# EAGLE schematic Sequencer-Memory-V1.0 (EAGLE 7.6.0)

## Sheet 1 of 4: CPU
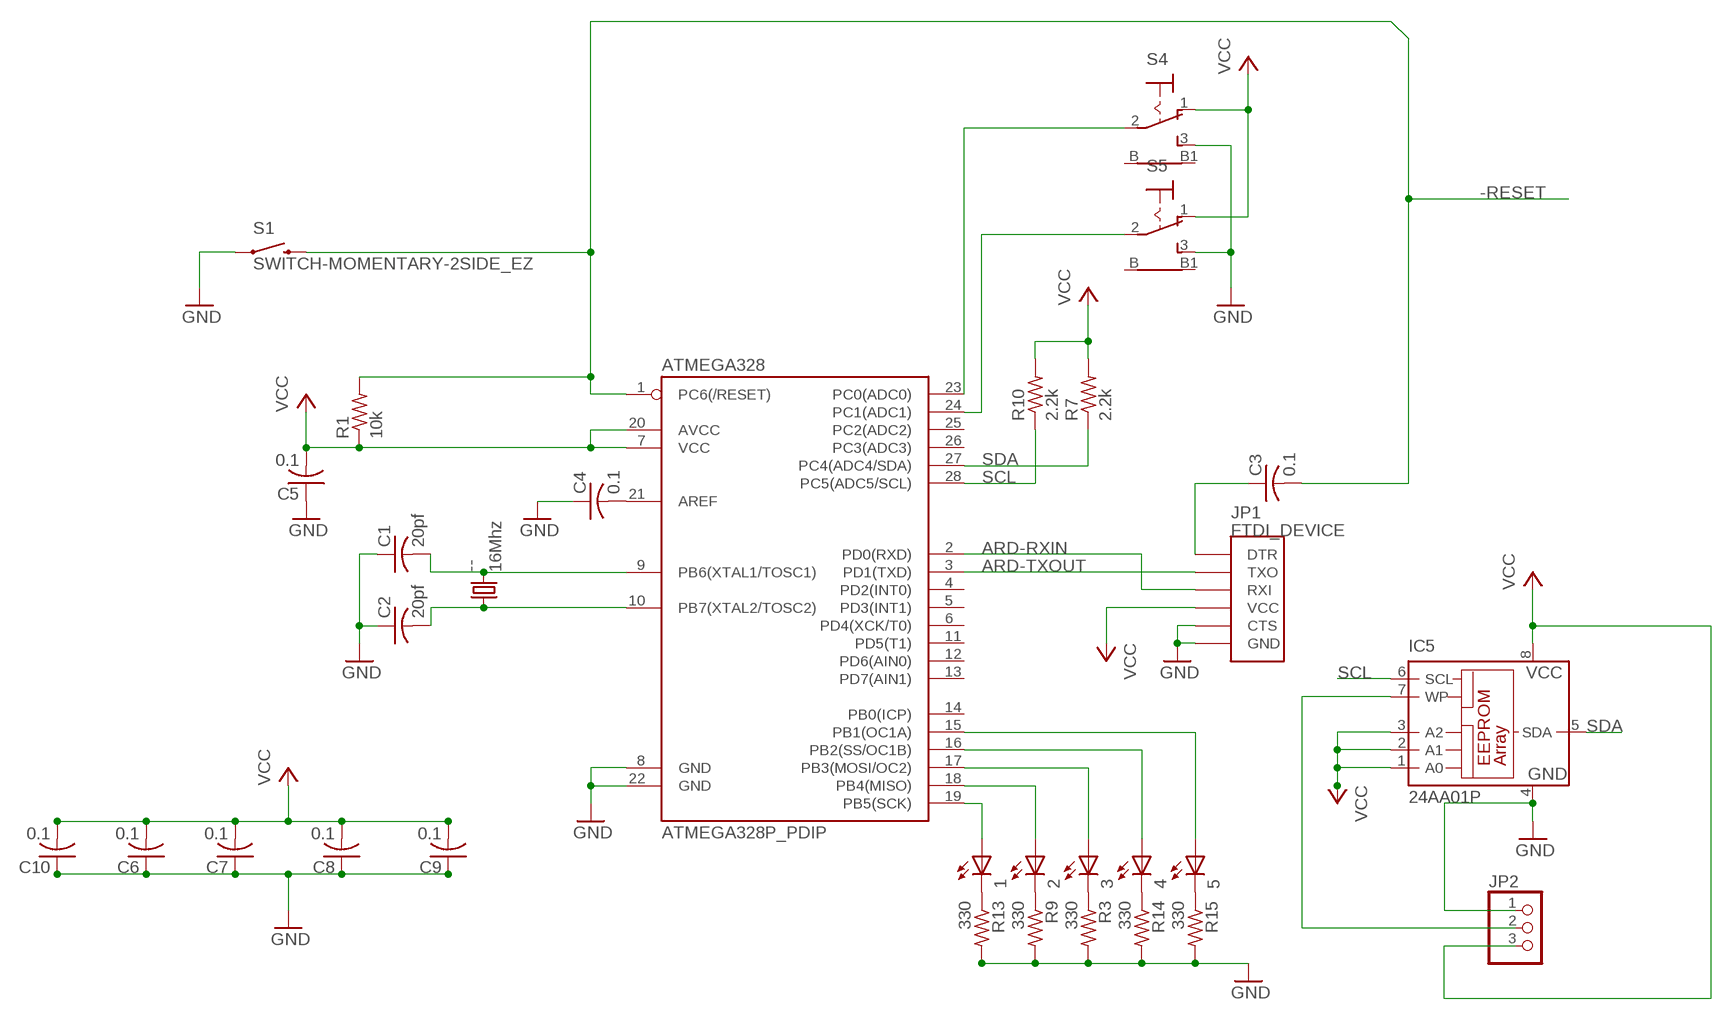
[diagram p0: schematic, sheet 1]

### Parts
1  LED5MM  [LED5MM]
2  LED5MM  [LED5MM]
3  LED5MM  [LED5MM]
4  LED5MM  [LED5MM]
5  LED5MM  [LED5MM]
--  16Mhz  CRYSTALHC49S  [HC49/S]
ATMEGA328  ATMEGA328P_PDIP  [DIL28-3]
C1  20pf  C-US025-024X044  [C025-024X044]
C2  20pf  C-US025-024X044  [C025-024X044]
C3  0.1  C-US025-024X044  [C025-024X044]
C4  0.1  C-US025-024X044  [C025-024X044]
C5  0.1  C-US025-024X044  [C025-024X044]
C6  0.1  C-US025-024X044  [C025-024X044]
C7  0.1  C-US025-024X044  [C025-024X044]
C8  0.1  C-US025-024X044  [C025-024X044]
C9  0.1  C-US025-024X044  [C025-024X044]
C10  0.1  C-US025-024X044  [C025-024X044]
IC5  24AA01P  [DIL8]
JP1  FTDI_DEVICE  [FTDI_DEVICE_SIDE]
JP2  PINHD-1X3  [1X03]
R1  10k  R-US_0207/10  [0207/10]
R3  330  R-US_0207/10  [0207/10]
R7  2.2k  R-US_0207/10  [0207/10]
R9  330  R-US_0207/10  [0207/10]
R10  2.2k  R-US_0207/10  [0207/10]
R13  330  R-US_0207/10  [0207/10]
R14  330  R-US_0207/10  [0207/10]
R15  330  R-US_0207/10  [0207/10]
S1  SWITCH-MOMENTARY-2SIDE_EZ  [TACTILE-PTH-SIDEEZ]
S4  9070-1W  [9070-1W]
S5  9070-1W  [9070-1W]

### Nets
-RESET: ATMEGA328.1(PC6(/RESET)) C3.2 R1.2 S1.2 ; also sheet 2
ARD-RXIN: ATMEGA328.2(PD0(RXD)) JP1.P$3(RXI)
ARD-TXOUT: ATMEGA328.3(PD1(TXD)) JP1.P$2(TXO)
GND: ATMEGA328.8(GND) ATMEGA328.22(GND) C1.1 C2.1 C4.1 C5.1 C6.1 C7.1 C8.1 C9.1 C10.1 IC5.4(GND) JP1.P$5(CTS) JP1.P$6(GND) JP2.1 R3.2 R9.2 R13.2 R14.2 R15.2 S1.1 S4.3(S) S5.3(S) ; also sheet 2,3,4
N$1: 1.A ATMEGA328.19(PB5(SCK))
N$2: IC5.7(WP) JP2.2
N$3: --.2 ATMEGA328.9(PB6(XTAL1/TOSC1)) C1.2
N$4: --.1 ATMEGA328.10(PB7(XTAL2/TOSC2)) C2.2
N$6: 2.A ATMEGA328.18(PB4(MISO))
N$7: 3.A ATMEGA328.17(PB3(MOSI/OC2))
N$8: 4.A ATMEGA328.16(PB2(SS/OC1B))
N$9: C3.1 JP1.P$1(DTR)
N$10: 5.A ATMEGA328.15(PB1(OC1A))
N$11: 2.K(C) R9.1
N$12: 1.K(C) R13.1
N$13: 3.K(C) R3.1
N$14: ATMEGA328.21(AREF) C4.2
N$15: 4.K(C) R14.1
N$16: 5.K(C) R15.1
N$18: ATMEGA328.23(PC0(ADC0)) S4.2(P)
N$19: ATMEGA328.24(PC1(ADC1)) S5.2(P)
SCL: ATMEGA328.28(PC5(ADC5/SCL)) IC5.6(SCL) R10.1 ; also sheet 2
SDA: ATMEGA328.27(PC4(ADC4/SDA)) IC5.5(SDA) R7.1 ; also sheet 2
VCC: ATMEGA328.7(VCC) ATMEGA328.20(AVCC) C5.2 C6.2 C7.2 C8.2 C9.2 C10.2 IC5.1(A0) IC5.2(A1) IC5.3(A2) IC5.8(VCC) JP1.P$4(VCC) JP2.3 R1.1 R7.2 R10.2 S4.1(O) S5.1(O) ; also sheet 2,3,4
Unconnected: ATMEGA328.4(PD2(INT0)) ATMEGA328.5(PD3(INT1)) ATMEGA328.6(PD4(XCK/T0)) ATMEGA328.11(PD5(T1)) ATMEGA328.12(PD6(AIN0)) ATMEGA328.13(PD7(AIN1)) ATMEGA328.14(PB0(ICP)) ATMEGA328.25(PC2(ADC2)) ATMEGA328.26(PC3(ADC3)) S4.B S4.B1 S5.B S5.B1

## Sheet 2 of 4: I/O
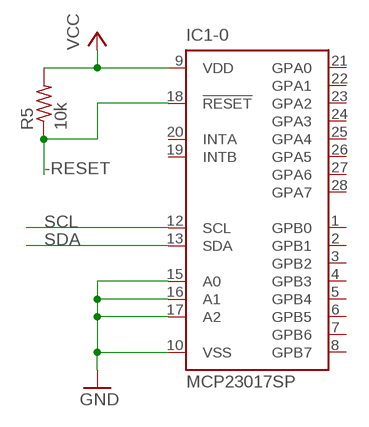
[diagram p1: schematic, sheet 2]

### Parts
IC1-0  MCP23017SP  [DIL28-3]
R5  10k  R-US_0207/10  [0207/10]

### Nets
-RESET: IC1-0.18(!RESET) R5.1 ; also sheet 1
GND: IC1-0.10(VSS) IC1-0.15(A0) IC1-0.16(A1) IC1-0.17(A2) ; also sheet 1,3,4
SCL: IC1-0.12(SCL) ; also sheet 1
SDA: IC1-0.13(SDA) ; also sheet 1
VCC: IC1-0.9(VDD) R5.2 ; also sheet 1,3,4
Unconnected: IC1-0.1(GPB0) IC1-0.2(GPB1) IC1-0.3(GPB2) IC1-0.4(GPB3) IC1-0.5(GPB4) IC1-0.6(GPB5) IC1-0.7(GPB6) IC1-0.8(GPB7) IC1-0.19(INTB) IC1-0.20(INTA) IC1-0.21(GPA0) IC1-0.22(GPA1) IC1-0.23(GPA2) IC1-0.24(GPA3) IC1-0.25(GPA4) IC1-0.26(GPA5) IC1-0.27(GPA6) IC1-0.28(GPA7)

## Sheet 3 of 4: Memory
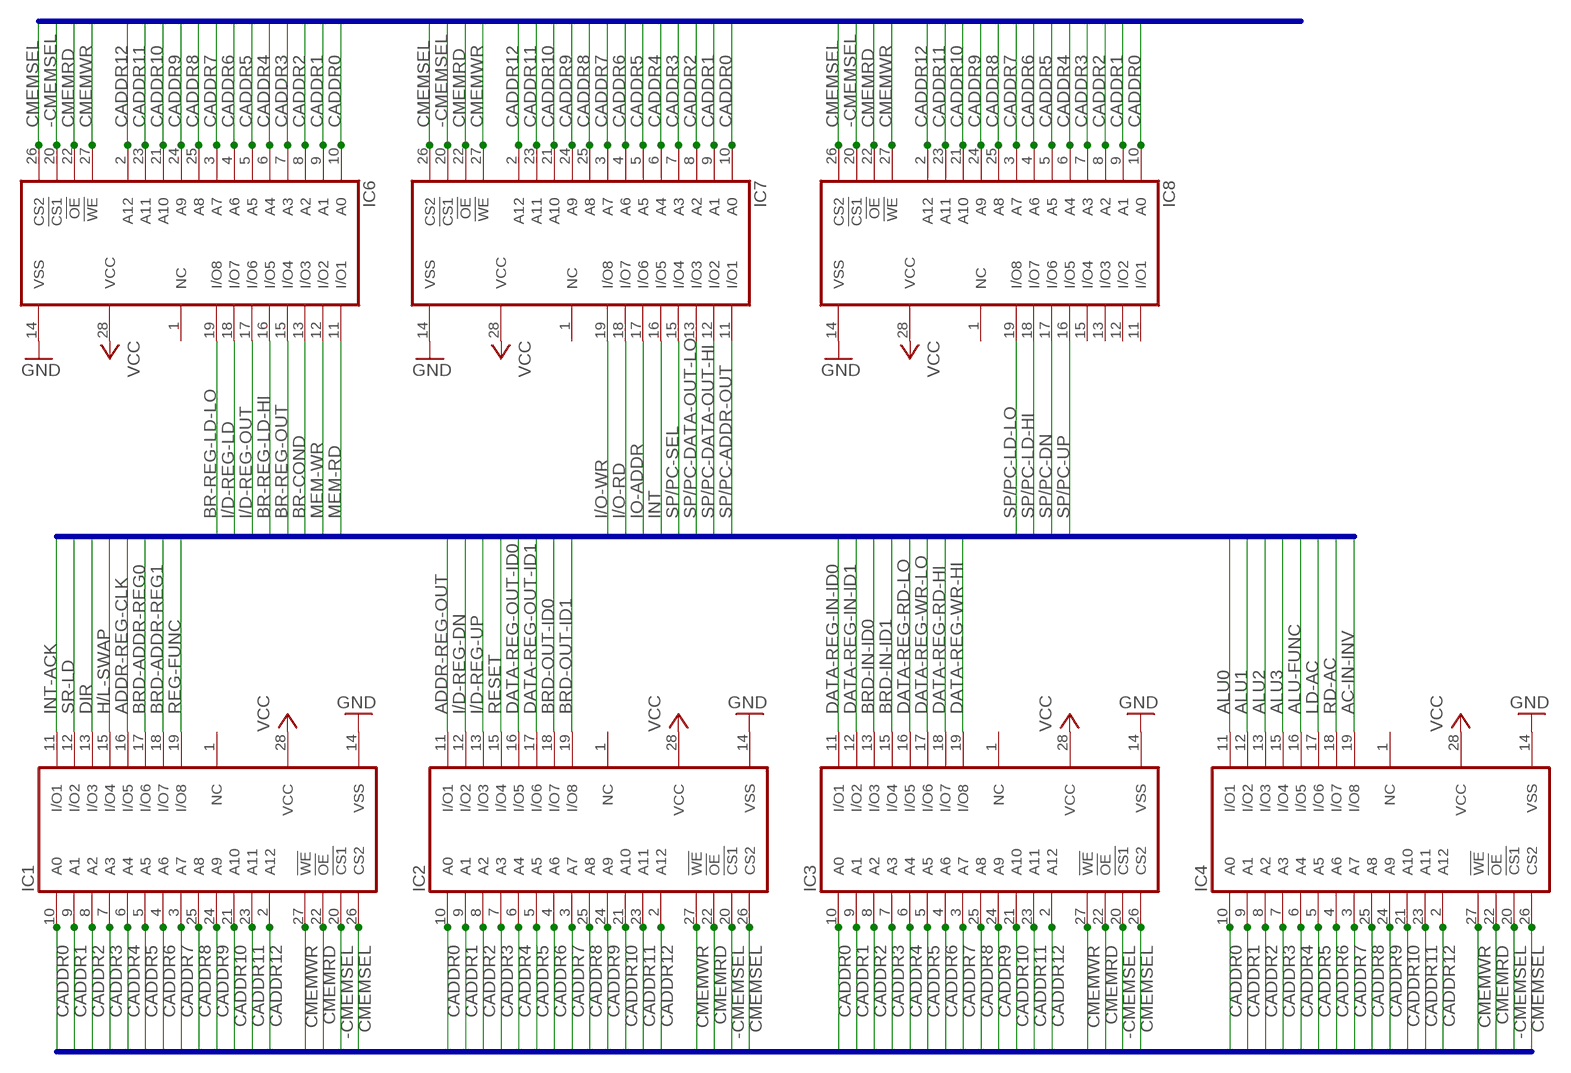
[diagram p2: schematic, sheet 3]

### Parts
IC1  6264A  [DIL28-6]
IC2  6264A  [DIL28-6]
IC3  6264A  [DIL28-6]
IC4  6264A  [DIL28-6]
IC6  6264A  [DIL28-6]
IC7  6264A  [DIL28-6]
IC8  6264A  [DIL28-6]

### Nets
-CMEMSEL: IC1.20(!CS1) IC2.20(!CS1) IC3.20(!CS1) IC4.20(!CS1) IC6.20(!CS1) IC7.20(!CS1) IC8.20(!CS1)
AC-IN-INV: IC4.19(I/O8) ; also sheet 4
ADDR-REG-CLK: IC1.16(I/O5) ; also sheet 4
ADDR-REG-OUT: IC2.11(I/O1) ; also sheet 4
ALU0: IC4.11(I/O1) ; also sheet 4
ALU1: IC4.12(I/O2) ; also sheet 4
ALU2: IC4.13(I/O3) ; also sheet 4
ALU3: IC4.15(I/O4) ; also sheet 4
ALU-FUNC: IC4.16(I/O5) ; also sheet 4
BR-COND: IC6.13(I/O3) ; also sheet 4
BR-REG-LD-HI: IC6.16(I/O5) ; also sheet 4
BR-REG-LD-LO: IC6.19(I/O8) ; also sheet 4
BR-REG-OUT: IC6.15(I/O4) ; also sheet 4
BRD-ADDR-REG0: IC1.17(I/O6) ; also sheet 4
BRD-ADDR-REG1: IC1.18(I/O7) ; also sheet 4
BRD-IN-ID0: IC3.13(I/O3) ; also sheet 4
BRD-IN-ID1: IC3.15(I/O4) ; also sheet 4
BRD-OUT-ID0: IC2.18(I/O7) ; also sheet 4
BRD-OUT-ID1: IC2.19(I/O8) ; also sheet 4
CADDR0: IC1.10(A0) IC2.10(A0) IC3.10(A0) IC4.10(A0) IC6.10(A0) IC7.10(A0) IC8.10(A0) ; also sheet 4
CADDR1: IC1.9(A1) IC2.9(A1) IC3.9(A1) IC4.9(A1) IC6.9(A1) IC7.9(A1) IC8.9(A1) ; also sheet 4
CADDR2: IC1.8(A2) IC2.8(A2) IC3.8(A2) IC4.8(A2) IC6.8(A2) IC7.8(A2) IC8.8(A2) ; also sheet 4
CADDR3: IC1.7(A3) IC2.7(A3) IC3.7(A3) IC4.7(A3) IC6.7(A3) IC7.7(A3) IC8.7(A3) ; also sheet 4
CADDR4: IC1.6(A4) IC2.6(A4) IC3.6(A4) IC4.6(A4) IC6.6(A4) IC7.6(A4) IC8.6(A4) ; also sheet 4
CADDR5: IC1.5(A5) IC2.5(A5) IC3.5(A5) IC4.5(A5) IC6.5(A5) IC7.5(A5) IC8.5(A5) ; also sheet 4
CADDR6: IC1.4(A6) IC2.4(A6) IC3.4(A6) IC4.4(A6) IC6.4(A6) IC7.4(A6) IC8.4(A6) ; also sheet 4
CADDR7: IC1.3(A7) IC2.3(A7) IC3.3(A7) IC4.3(A7) IC6.3(A7) IC7.3(A7) IC8.3(A7) ; also sheet 4
CADDR8: IC1.25(A8) IC2.25(A8) IC3.25(A8) IC4.25(A8) IC6.25(A8) IC7.25(A8) IC8.25(A8) ; also sheet 4
CADDR9: IC1.24(A9) IC2.24(A9) IC3.24(A9) IC4.24(A9) IC6.24(A9) IC7.24(A9) IC8.24(A9) ; also sheet 4
CADDR10: IC1.21(A10) IC2.21(A10) IC3.21(A10) IC4.21(A10) IC6.21(A10) IC7.21(A10) IC8.21(A10) ; also sheet 4
CADDR11: IC1.23(A11) IC2.23(A11) IC3.23(A11) IC4.23(A11) IC6.23(A11) IC7.23(A11) IC8.23(A11) ; also sheet 4
CADDR12: IC1.2(A12) IC2.2(A12) IC3.2(A12) IC4.2(A12) IC6.2(A12) IC7.2(A12) IC8.2(A12) ; also sheet 4
CMEMRD: IC1.22(!OE) IC2.22(!OE) IC3.22(!OE) IC4.22(!OE) IC6.22(!OE) IC7.22(!OE) IC8.22(!OE)
CMEMSEL: IC1.26(CS2) IC2.26(CS2) IC3.26(CS2) IC4.26(CS2) IC6.26(CS2) IC7.26(CS2) IC8.26(CS2)
CMEMWR: IC1.27(!WE) IC2.27(!WE) IC3.27(!WE) IC4.27(!WE) IC6.27(!WE) IC7.27(!WE) IC8.27(!WE)
DATA-REG-IN-ID0: IC3.11(I/O1) ; also sheet 4
DATA-REG-IN-ID1: IC3.12(I/O2) ; also sheet 4
DATA-REG-OUT-ID0: IC2.16(I/O5) ; also sheet 4
DATA-REG-OUT-ID1: IC2.17(I/O6) ; also sheet 4
DATA-REG-RD-HI: IC3.18(I/O7) ; also sheet 4
DATA-REG-RD-LO: IC3.16(I/O5) ; also sheet 4
DATA-REG-WR-HI: IC3.19(I/O8) ; also sheet 4
DATA-REG-WR-LO: IC3.17(I/O6) ; also sheet 4
DIR: IC1.13(I/O3) ; also sheet 4
GND: IC1.14(VSS) IC2.14(VSS) IC3.14(VSS) IC4.14(VSS) IC6.14(VSS) IC7.14(VSS) IC8.14(VSS) ; also sheet 1,2,4
H/L-SWAP: IC1.15(I/O4) ; also sheet 4
I/D-REG-DN: IC2.12(I/O2) ; also sheet 4
I/D-REG-LD: IC6.18(I/O7) ; also sheet 4
I/D-REG-OUT: IC6.17(I/O6) ; also sheet 4
I/D-REG-UP: IC2.13(I/O3) ; also sheet 4
I/O-RD: IC7.18(I/O7) ; also sheet 4
I/O-WR: IC7.19(I/O8) ; also sheet 4
INT: IC7.16(I/O5) ; also sheet 4
INT-ACK: IC1.11(I/O1) ; also sheet 4
IO-ADDR: IC7.17(I/O6) ; also sheet 4
LD-AC: IC4.17(I/O6) ; also sheet 4
MEM-RD: IC6.11(I/O1) ; also sheet 4
MEM-WR: IC6.12(I/O2) ; also sheet 4
RD-AC: IC4.18(I/O7) ; also sheet 4
REG-FUNC: IC1.19(I/O8) ; also sheet 4
RESET: IC2.15(I/O4) ; also sheet 4
SP/PC-ADDR-OUT: IC7.11(I/O1) ; also sheet 4
SP/PC-DATA-OUT-HI: IC7.12(I/O2) ; also sheet 4
SP/PC-DATA-OUT-LO: IC7.13(I/O3) ; also sheet 4
SP/PC-DN: IC8.17(I/O6) ; also sheet 4
SP/PC-LD-HI: IC8.18(I/O7) ; also sheet 4
SP/PC-LD-LO: IC8.19(I/O8) ; also sheet 4
SP/PC-SEL: IC7.15(I/O4) ; also sheet 4
SP/PC-UP: IC8.16(I/O5) ; also sheet 4
SR-LD: IC1.12(I/O2) ; also sheet 4
VCC: IC1.28(VCC) IC2.28(VCC) IC3.28(VCC) IC4.28(VCC) IC6.28(VCC) IC7.28(VCC) IC8.28(VCC) ; also sheet 1,2,4
Unconnected: IC1.1(NC) IC2.1(NC) IC3.1(NC) IC4.1(NC) IC6.1(NC) IC7.1(NC) IC8.1(NC) IC8.11(I/O1) IC8.12(I/O2) IC8.13(I/O3) IC8.15(I/O4)

### Buses
ADDR[0..15],DATA[0..15],SR-LD,DIR,H/L-SWAP,ADDR-REG-CLK,BRD-ADDR-REG[0..1],REG-FUNC,ADDR-REG-OUT,I/D-REG-DN,I/D-REG-UP,RESET,DATA-REG-OUT-ID[0..1],BRD-OUT-ID[0..1],DATA-REG-IN-ID[0..1],BRD-IN-ID[0..1],DATA-REG-RD-LO,DATA-REG-WR-LO,DATA-REG-RD-HI,DATA-REG-WR-HI,ALU[0..3],ALU-FUNC,LD-AC,RD-AC,AC-IN-INV,BR-REG-LD-LO,I/D-REG-LD,I/D-REG-OUT,BR-REG-LD-HI,BR-REG-OUT,BR-COND,MEM-WR,MEM-RD,I/O-WR,I/O-RD,IO-ADDR,INT,SP/PC-SEL,SP/PC-DATA-OUT-LO,SP/PC-DATA-OUT-HI,SP/PC-ADDR-OUT,SP/PC-LD-LO,SP/PC-LD-HI,SP/PC-DN,SP/PC-UP,INT-ACK
CADDR[0..12],CMEMWR,CMEMRD,CMEMSEL,-CMEMSEL

## Sheet 4 of 4: Connector
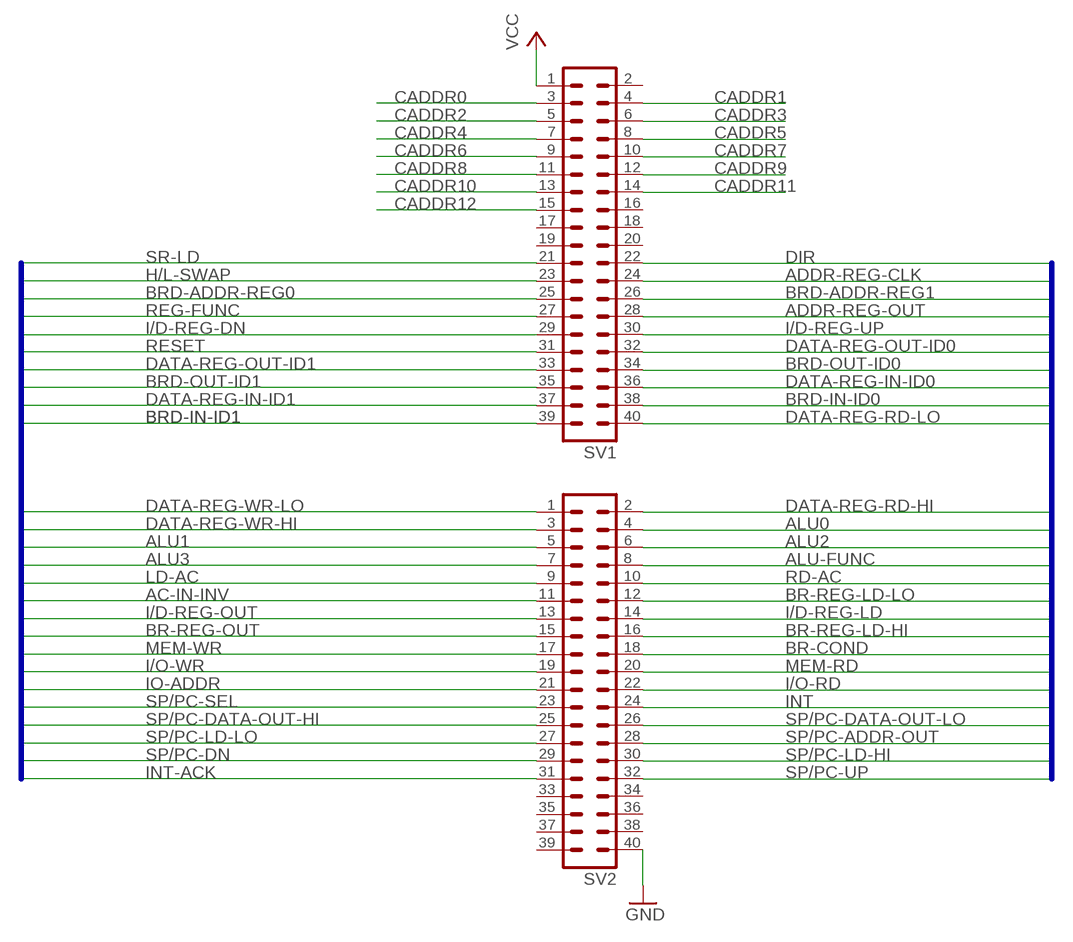
[diagram p3: schematic, sheet 4]

### Parts
SV1  MA20-2  [MA20-2]
SV2  MA20-2  [MA20-2]

### Nets
AC-IN-INV: SV2.11 ; also sheet 3
ADDR-REG-CLK: SV1.24 ; also sheet 3
ADDR-REG-OUT: SV1.28 ; also sheet 3
ALU0: SV2.4 ; also sheet 3
ALU1: SV2.5 ; also sheet 3
ALU2: SV2.6 ; also sheet 3
ALU3: SV2.7 ; also sheet 3
ALU-FUNC: SV2.8 ; also sheet 3
BR-COND: SV2.18 ; also sheet 3
BR-REG-LD-HI: SV2.16 ; also sheet 3
BR-REG-LD-LO: SV2.12 ; also sheet 3
BR-REG-OUT: SV2.15 ; also sheet 3
BRD-ADDR-REG0: SV1.25 ; also sheet 3
BRD-ADDR-REG1: SV1.26 ; also sheet 3
BRD-IN-ID0: SV1.38 ; also sheet 3
BRD-IN-ID1: SV1.39 ; also sheet 3
BRD-OUT-ID0: SV1.34 ; also sheet 3
BRD-OUT-ID1: SV1.35 ; also sheet 3
CADDR0: SV1.3 ; also sheet 3
CADDR1: SV1.4 ; also sheet 3
CADDR2: SV1.5 ; also sheet 3
CADDR3: SV1.6 ; also sheet 3
CADDR4: SV1.7 ; also sheet 3
CADDR5: SV1.8 ; also sheet 3
CADDR6: SV1.9 ; also sheet 3
CADDR7: SV1.10 ; also sheet 3
CADDR8: SV1.11 ; also sheet 3
CADDR9: SV1.12 ; also sheet 3
CADDR10: SV1.13 ; also sheet 3
CADDR11: SV1.14 ; also sheet 3
CADDR12: SV1.15 ; also sheet 3
DATA-REG-IN-ID0: SV1.36 ; also sheet 3
DATA-REG-IN-ID1: SV1.37 ; also sheet 3
DATA-REG-OUT-ID0: SV1.32 ; also sheet 3
DATA-REG-OUT-ID1: SV1.33 ; also sheet 3
DATA-REG-RD-HI: SV2.2 ; also sheet 3
DATA-REG-RD-LO: SV1.40 ; also sheet 3
DATA-REG-WR-HI: SV2.3 ; also sheet 3
DATA-REG-WR-LO: SV2.1 ; also sheet 3
DIR: SV1.22 ; also sheet 3
GND: SV2.40 ; also sheet 1,2,3
H/L-SWAP: SV1.23 ; also sheet 3
I/D-REG-DN: SV1.29 ; also sheet 3
I/D-REG-LD: SV2.14 ; also sheet 3
I/D-REG-OUT: SV2.13 ; also sheet 3
I/D-REG-UP: SV1.30 ; also sheet 3
I/O-RD: SV2.22 ; also sheet 3
I/O-WR: SV2.19 ; also sheet 3
INT: SV2.24 ; also sheet 3
INT-ACK: SV2.31 ; also sheet 3
IO-ADDR: SV2.21 ; also sheet 3
LD-AC: SV2.9 ; also sheet 3
MEM-RD: SV2.20 ; also sheet 3
MEM-WR: SV2.17 ; also sheet 3
RD-AC: SV2.10 ; also sheet 3
REG-FUNC: SV1.27 ; also sheet 3
RESET: SV1.31 ; also sheet 3
SP/PC-ADDR-OUT: SV2.28 ; also sheet 3
SP/PC-DATA-OUT-HI: SV2.25 ; also sheet 3
SP/PC-DATA-OUT-LO: SV2.26 ; also sheet 3
SP/PC-DN: SV2.29 ; also sheet 3
SP/PC-LD-HI: SV2.30 ; also sheet 3
SP/PC-LD-LO: SV2.27 ; also sheet 3
SP/PC-SEL: SV2.23 ; also sheet 3
SP/PC-UP: SV2.32 ; also sheet 3
SR-LD: SV1.21 ; also sheet 3
VCC: SV1.1 ; also sheet 1,2,3
Unconnected: SV1.2 SV1.16 SV1.17 SV1.18 SV1.19 SV1.20 SV2.33 SV2.34 SV2.35 SV2.36 SV2.37 SV2.38 SV2.39

### Buses
ADDR[0..15],DATA[0..15],SR-LD,DIR,H/L-SWAP,ADDR-REG-CLK,BRD-ADDR-REG[0..1],REG-FUNC,ADDR-REG-OUT,I/D-REG-DN,I/D-REG-UP,RESET,DATA-REG-OUT-ID[0..1],BRD-OUT-ID[0..1],DATA-REG-IN-ID[0..1],BRD-IN-ID[0..1],DATA-REG-RD-LO,DATA-REG-WR-LO,DATA-REG-RD-HI,DATA-REG-WR-HI,ALU[0..3],ALU-FUNC,LD-AC,RD-AC,AC-IN-INV,BR-REG-LD-LO,I/D-REG-LD,I/D-REG-OUT,BR-REG-LD-HI,BR-REG-OUT,BR-COND,MEM-WR,MEM-RD,I/O-WR,I/O-RD,IO-ADDR,INT,SP/PC-SEL,SP/PC-DATA-OUT-LO,SP/PC-DATA-OUT-HI,SP/PC-ADDR-OUT,SP/PC-LD-LO,SP/PC-LD-HI,SP/PC-DN,SP/PC-UP,INT-ACK

## Library data of the parts
1-5 = led:LED: LED OSRAM: - CHIPLED LG R971, LG N971, LY N971, LG Q971, LY Q971, LO R971, LY R971 LH N974, LH R974 LS Q976, LO Q976, LY Q976 LO Q996 - Hyper CHIPLED LW Q18S LB Q993, LB Q99A, LB R99A - SideLED LS A670, LO A670, LY A670, LG A670, LP A670 LB A673, LV A673, LT A673, LW A673 LH A674 LY A675 LS A676, LA A676, LO A676, LY A676, LW A676 LS A679, LY A679, LG A679 - Hyper Micro SIDELED® LS Y876, LA Y876, LO Y876, LY Y876 LT Y87S - SmartLED LW L88C, LW L88S LB L89C, LB L89S, LG L890 LS L89K, LO L89K, LY L89K LS L896, LA L896, LO L896, LY L896 - TOPLED LS T670, LO T670, LY T670, LG T670, LP T670 LSG T670, LSP T670, LSY T670, LOP T670, LYG T670 LG T671, LOG T671, LSG T671 LB T673, LV T673, LT T673, LW T673 LH T674 LS T676, LA T676, LO T676, LY T676, LB T676, LH T676, LSB T676, LW T676 LB T67C, LV T67C, LT T67C, LS T67K, LO T67K, LY T67K, LW E67C LS E67B, LA E67B, LO E67B, LY E67B, LB E67C, LV E67C, LT E67C LW T67C LS T679, LY T679, LG T679 LS T770, LO T770, LY T770, LG T770, LP T770 LB T773, LV T773, LT T773, LW T773 LH T774 LS E675, LA E675, LY E675, LS T675 LS T776, LA T776, LO T776, LY T776, LB T776 LHGB T686 LT T68C, LB T68C - Hyper Mini TOPLED® LB M676 - Mini TOPLED Santana® LG M470 LS M47K, LO M47K, LY M47K Source: http://www.osram.convergy.de LUXEON: - LUMILED® LXK2-PW12-R00, LXK2-PW12-S00, LXK2-PW14-U00, LXK2-PW14-V00 LXK2-PM12-R00, LXK2-PM12-S00, LXK2-PM14-U00 LXK2-PE12-Q00, LXK2-PE12-R00, LXK2-PE12-S00, LXK2-PE14-T00, LXK2-PE14-U00 LXK2-PB12-K00, LXK2-PB12-L00, LXK2-PB12-M00, LXK2-PB14-N00, LXK2-PB14-P00, LXK2-PB14-Q00 LXK2-PR12-L00, LXK2-PR12-M00, LXK2-PR14-Q00, LXK2-PR14-R00 LXK2-PD12-Q00, LXK2-PD12-R00, LXK2-PD12-S00 LXK2-PH12-R00, LXK2-PH12-S00 LXK2-PL12-P00, LXK2-PL12-Q00, LXK2-PL12-R00 Source: www.luxeon.com KINGBRIGHT: KA-3528ASYC Source: www.kingbright.com
-- = crystal:CRYSTAL: CRYSTAL; OC_FARNELL: 1667008; OC_NEWARK: unknown
ATMEGA328 = SparkFun-DigitalIC:ATMEGA328P_PDIP: uC used in the Arduino 32kb flash, 1k EEPROM, 2k SRAM This is the through-hole version of this chip.
C1-C10 = adafruit:C-US: CAPACITOR, American symbol
IC1-IC4 IC6-IC8 = memory-hitachi:6264A: MEMORY; OC_FARNELL: 283605; OC_NEWARK: unknown
IC1-0 = microchip:MCP23017: http://ww1.microchip.com/downloads/en/DeviceDoc/21952a.pdf Source: http://ww1.microchip.com/downloads/en/DeviceDoc/21952a.pdf; MF: MICROCHIP; MPN: MCP23017-E/SP; OC_FARNELL: 1332088; OC_NEWARK: 31K2959
IC5 = microchip:24*: Serial EEPROM I2C; MPN: 24AA01-I/P; OC_FARNELL: 1331266; OC_NEWARK: 35M0692
JP1 = SparkFun-Connectors:FTDI_DEVICE: Connector which mates to FTDI basic or FTDI cable.
JP2 = pinhead:PINHD-1X3: PIN HEADER
R1 R3 R7 R9 R10 R13-R15 = resistor:R-US_: RESISTOR, American symbol
R5 = adafruit:R-US_: RESISTOR, American symbol
S1 = SparkFun-Electromechanical:SWITCH-MOMENTARY-2: Various NO switches- pushbuttons, reed, etc
S4 S5 = switch:9070-1W: TOGGLE SWITCH Marquardt
SV1 SV2 = con-lstb:MA20-2: PIN HEADER; OC_FARNELL: unknown; OC_NEWARK: unknown